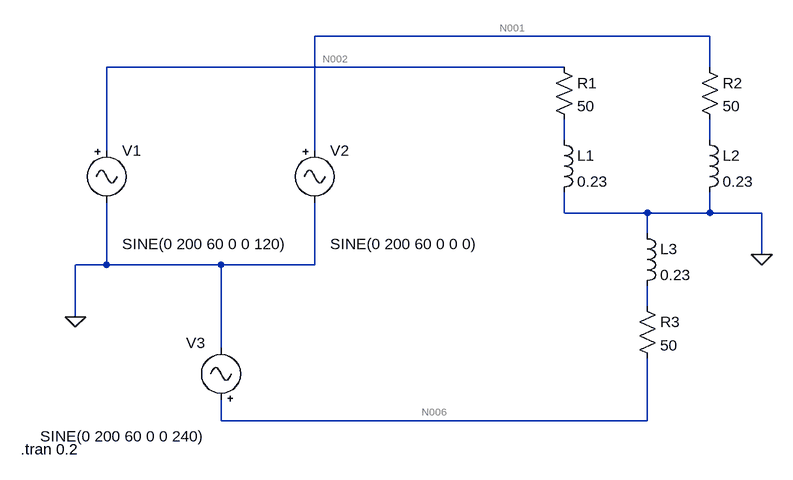
[diagram p0: schematic 2.asc]
2.asc, the LTspice schematic file:
Version 4
SHEET 1 1044 680
WIRE 944 -144 336 -144
WIRE 720 -96 16 -96
WIRE 944 -96 944 -144
WIRE 720 16 720 -16
WIRE 944 16 944 -16
WIRE 16 32 16 -96
WIRE 336 32 336 -144
WIRE 720 128 720 96
WIRE 848 128 720 128
WIRE 944 128 944 96
WIRE 944 128 848 128
WIRE 1024 128 944 128
WIRE 848 160 848 128
WIRE 1024 192 1024 128
WIRE 16 208 16 112
WIRE 16 208 -32 208
WIRE 192 208 16 208
WIRE 336 208 336 112
WIRE 336 208 192 208
WIRE 848 272 848 240
WIRE -32 288 -32 208
WIRE 192 336 192 208
WIRE 192 448 192 416
WIRE 848 448 848 352
WIRE 848 448 192 448
FLAG -32 288 0
FLAG 1024 192 0
SYMBOL Misc\\signal 16 16 R0
WINDOW 123 24 132 Left 2
WINDOW 39 0 0 Left 2
WINDOW 3 24 160 Left 2
SYMATTR InstName V1
SYMATTR Value SINE(0 200 60 0 0 120)
SYMBOL Misc\\signal 336 16 R0
WINDOW 123 24 132 Left 2
WINDOW 39 0 0 Left 2
WINDOW 3 24 160 Left 2
SYMATTR InstName V2
SYMATTR Value SINE(0 200 60 0 0 0)
SYMBOL Misc\\signal 192 432 R180
WINDOW 0 24 104 Left 2
WINDOW 3 24 -40 Left 2
WINDOW 123 24 -12 Left 2
WINDOW 39 0 0 Left 2
SYMATTR InstName V3
SYMATTR Value SINE(0 200 60 0 0 240)
SYMBOL ind 704 0 R0
SYMATTR InstName L1
SYMATTR Value 0.23
SYMBOL ind 928 0 R0
SYMATTR InstName L2
SYMATTR Value 0.23
SYMBOL ind 832 144 R0
SYMATTR InstName L3
SYMATTR Value 0.23
SYMBOL res 704 -112 R0
SYMATTR InstName R1
SYMATTR Value 50
SYMBOL res 928 -112 R0
SYMATTR InstName R2
SYMATTR Value 50
SYMBOL res 832 256 R0
SYMATTR InstName R3
SYMATTR Value 50
TEXT -116 492 Left 2 !.tran 0.2

The netlist it stands for:
* 2.asc
V1 N002 0 SINE(0 200 60 0 0 120)
V2 N001 0 SINE(0 200 60 0 0 0)
V3 N006 0 SINE(0 200 60 0 0 240)
L1 N003 0 0.23
L2 N004 0 0.23
L3 0 N005 0.23
R1 N002 N003 50
R2 N001 N004 50
R3 N005 N006 50
.tran 0.2
.backanno
.end

* Results of the author's LTspice run, read from the files saved beside the schematic
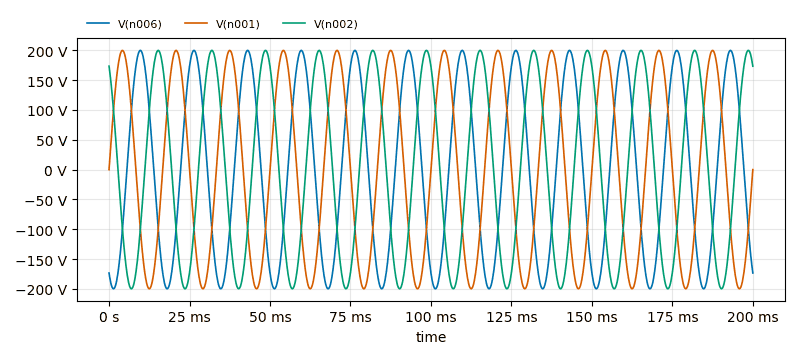
[diagram p1: Transient Analysis of 2.asc, plotted from the saved traces]
* Transient Analysis, 1 run:
*   V(n006): min -199.7 V, max 199.7 V, average -443.1 µV, rms 141.2 V, last -173.2 V
*   V(n001): min -199.7 V, max 199.7 V, average 0 V, rms 141.2 V, last 0 V
*   V(n002): min -199.7 V, max 199.7 V, average 430.3 µV, rms 141.2 V, last 173.2 V